# EAGLE design slush_alt_board_rev_a (EAGLE 8.5.0)
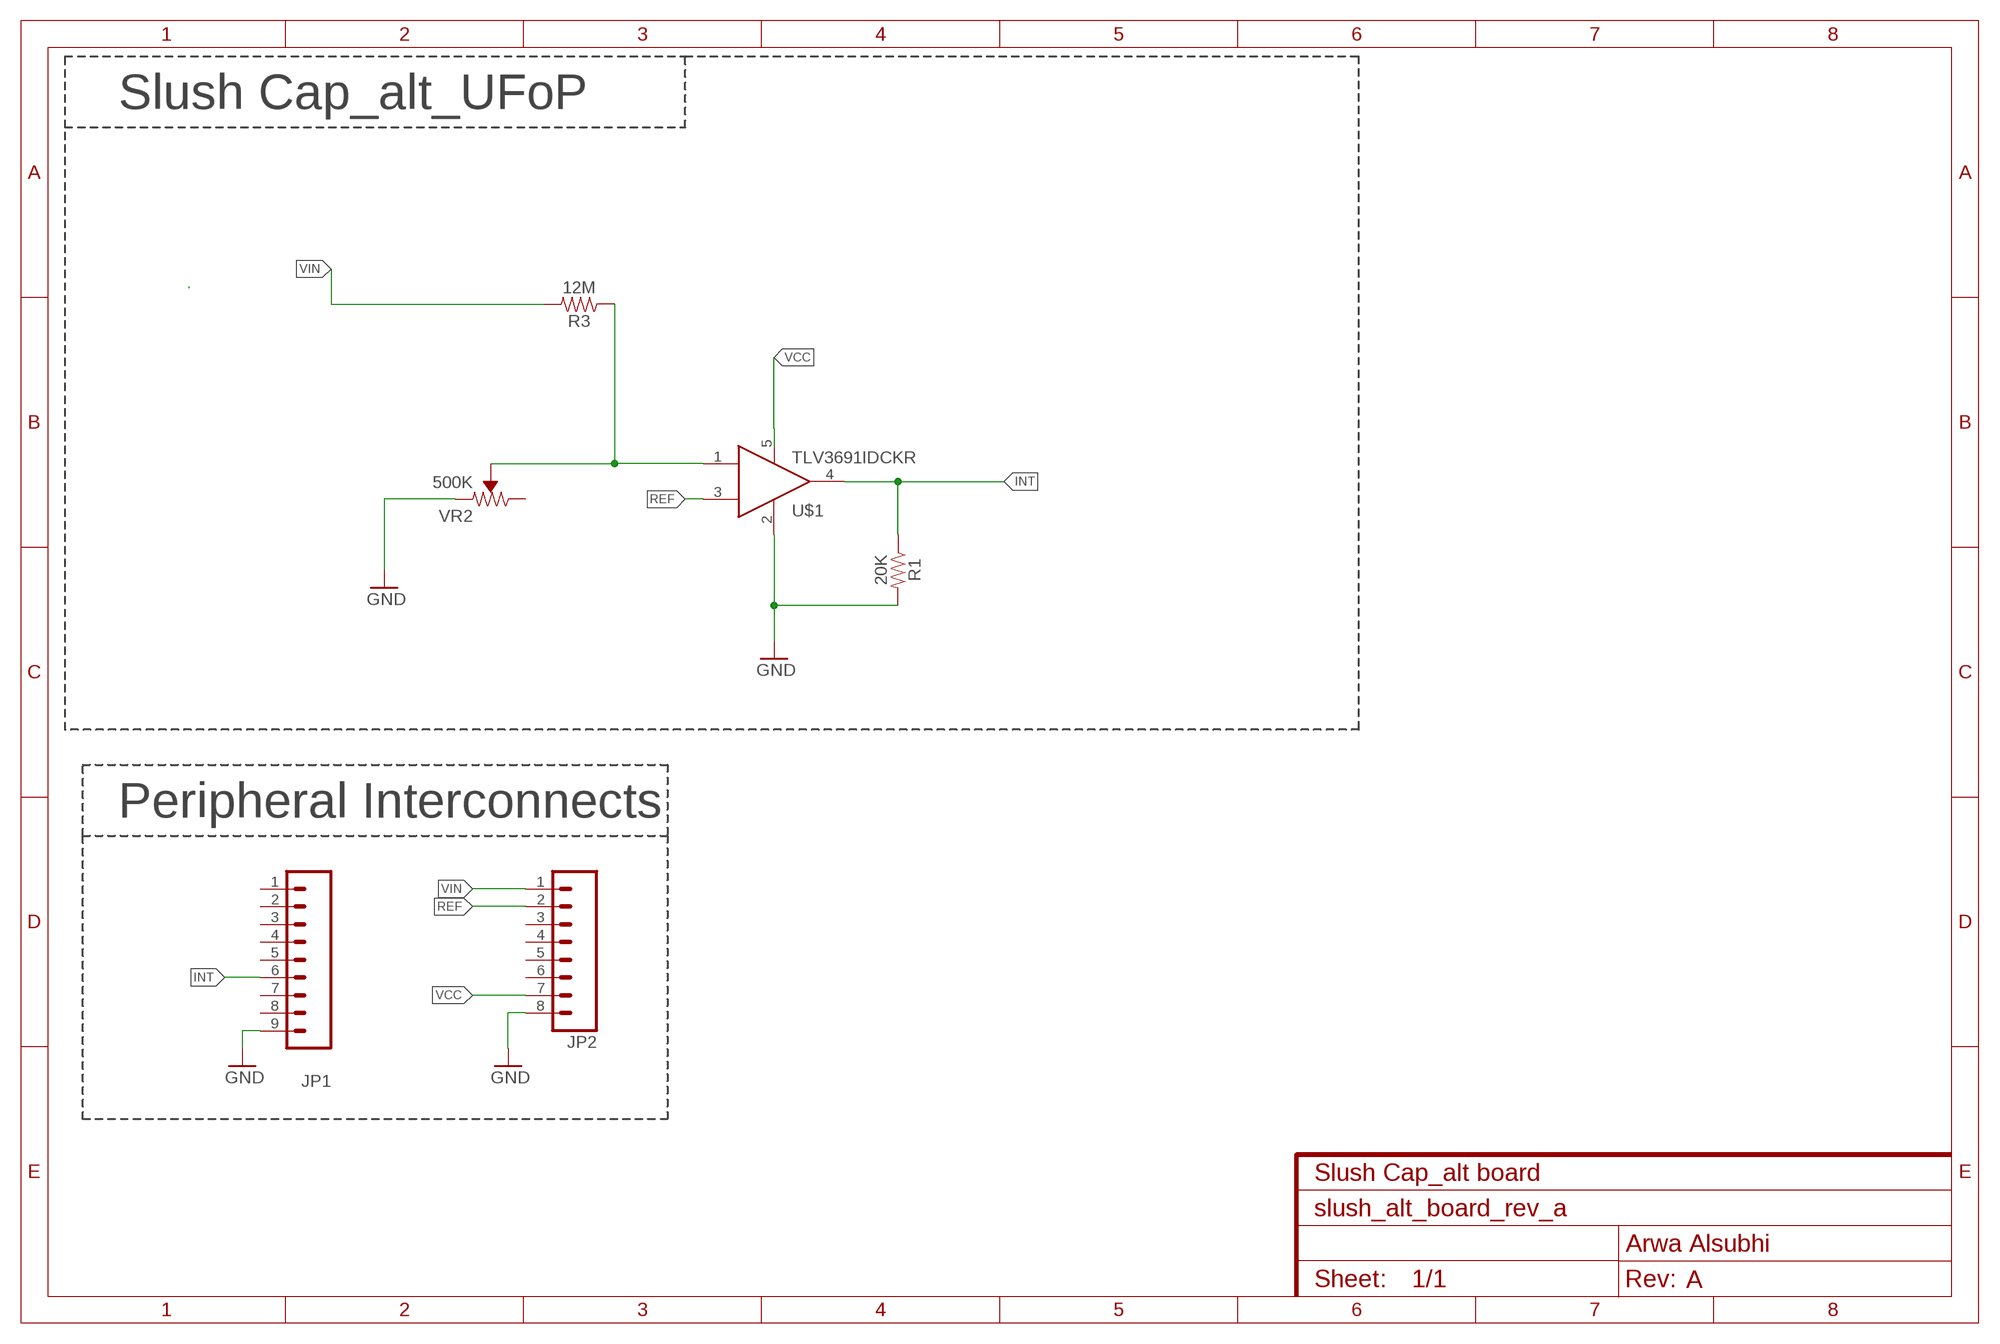
[diagram p0: schematic, sheet 1]
FRAME2 (FRAME-A4L): CNAME: Slush Cap_alt board; CREVISION: A; DESIGNER: Arwa Alsubhi

## Parts
JP1  M091.27MM  [1X09-1.27MM]
JP2  M081.27MM  [1X08-1.27MM]
R1  20K  0.3OHM-0805-1/8W-1%  [0805]
R3  12M  0.3OHM-0805-1/8W-1%  [0805]
U$1  TLV3691IDCKR  [SOT353]
VR2  500K  TRIMPOT-SMD-3MM-CLOSED-1/8W-20%  [TRIMPOT-SMD-3MM-CLOSED]

## Nets
GND: JP1.9 JP2.8 R1.2 U$1.2 VR2.1(CCW)
INT: JP1.6 R1.1 U$1.4
N$1: R3.2
N$5: R3.1 U$1.1 VR2.2(WIPER)
REF: JP2.2 U$1.3
VCC: JP2.7 U$1.5
VIN: JP2.1
Unconnected: JP1.1 JP1.2 JP1.3 JP1.4 JP1.5 JP1.7 JP1.8 JP2.3 JP2.4 JP2.5 JP2.6 VR2.3(CW)

## Notes on the sheet
- Slush Cap_alt_UFoP
- Peripheral Interconnects

## Library data of the parts
JP1 = SparkFun-Connectors:M09: Header 9 Standard 9-pin 0.1" header. Use with straight break away headers (SKU : PRT-00116), right angle break away headers (PRT-00553), swiss pins (PRT-00743), machine pins (PRT-00117), and female headers (PRT-00115).; DIGIKEY: S9014E-09-ND; MANUFACTURERPARTNUMBER: GRPB091VWVN-RC; MPN: GRPB091VWVN-RC
JP2 = SparkFun-Connectors:M08: Header 8 Standard 8-pin 0.1" header. Use with straight break away headers (SKU : PRT-00116), right angle break away headers (PRT-00553), swiss pins (PRT-00743), machine pins (PRT-00117), and female headers (PRT-00115).; DIGIKEY: S9014E-08-ND; MANUFACTURERPARTNUMBER: GRPB081VWVN-RC; MPN: GRPB081VWVN-RC
R1 R3 = SparkFun-Resistors:0.3OHM: 0.3Ω resistor A resistor is a passive two-terminal electrical component that implements electrical resistance as a circuit element. Resistors act to reduce current flow, and, at the same time, act to lower voltage levels within circuits. - Wikipedia; PROD_ID: RES-11622; VALUE: 0.3
U$1 = Arwa_lib:TLV3691IDCKR
VR2 = SparkFun-Resistors:TRIMPOT: Trimming Potentiometer (Trimpot) Three-terminal potentiometers, with an adjustable wiper and two adjustable resistors. A pot can be used to create a configurable voltage divider, or as a variable resistor. "Trimpots" are a subset of potentiometers, usually intended for "set-and-forget" applications. They're often more delicate than standard potentiometers - rated for fewer turns. Variants PTH-KNOB - PTH Trimpot w/ finger-adjustable knob Trimpot 10K with Knob <https://www.sparkfun.com/products/9806> (COM-09806) Datasheet <http://www.sparkfun.com/datasheets/Components/General/TSR-3386.pdf> SMD-3MM-CLOSED-FRAME - SMD 3mm Square Closed-Frame Trimpot Used on e.g. EasyDriver - Stepper Motor Driver <https://www.sparkfun.com/products/12779> Datasheet <http://www.bitechnologies.com/pdfs/22.pdf> (22AR10KTR) SMD-5MM - SMD 5mm Square Closed-Frame Trimpot Used on e.g. IOIO-OTG - V2.2 <https://www.sparkfun.com/products/13613> Datasheet <http://www.vishay.com/docs/51008/ts53.pdf> (TS53YL502MR10) SMD-3MM-1/10W-25% - 3mm Square Open-Frame Trimpot Used on e.g. SparkFun Shapeoko <https://www.sparkfun.com/products/13899> Datasheet <http://www.bourns.com/docs/Product-Datasheets/TC33.pdf> (TC33X-2-103E); PROD_ID: RES-09285; VALUE: 10k

## Board
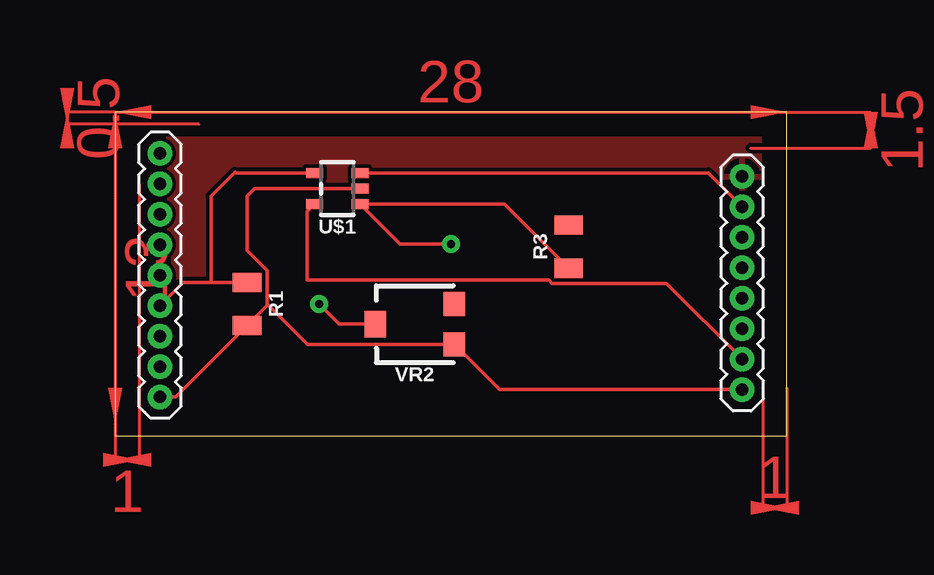
[diagram p1: board, top side]
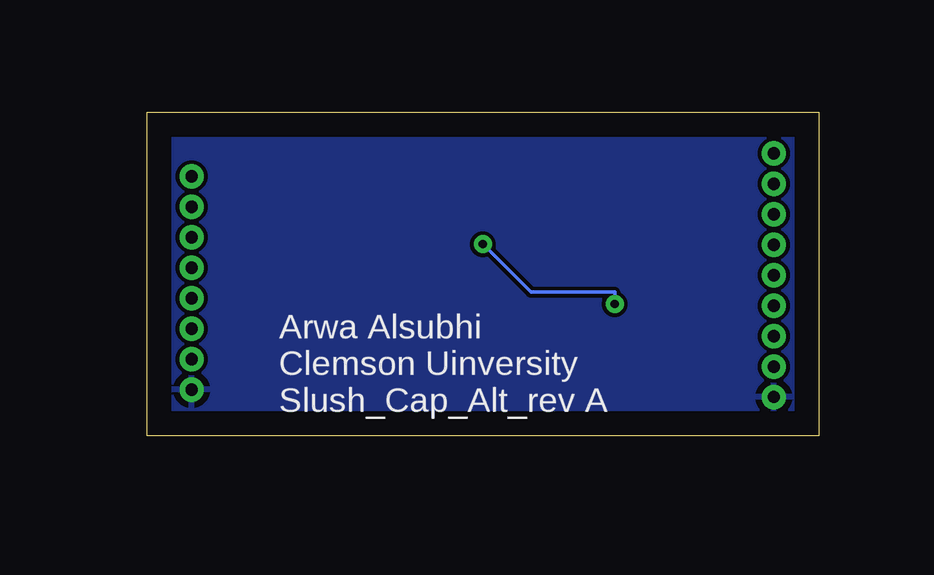
[diagram p2: board, bottom side, seen from below]

Size 28 x 13.5 mm. Coordinates in mm from the lower left corner, seen from the top.
Outline: 0,0 28,0 28,13.5 0,13.5 0,0
Copper layers (1*16): Top 0.035mm / dielectric 1.5mm / Bottom 0.035mm
Design rules "default": minimum track width 6mil, minimum drill 0.35mm, track to track 6mil, track to pad 6mil, pad to pad 6mil, via to via 6mil, smd to smd 6mil, copper to edge 40mil, drill to drill 6mil, minimum pad ring 10mil, minimum via ring 8mil, stop-mask expansion 4mil, vias tented up to drill 0mil, thermal gap 10mil

### Footprints (pad centres in the part's own frame; a part is rotated, then mirrored left to right if it is on the bottom)
1X09-1.27MM = drill 0.508 pad 1: 1 0,0; 2 1.27,0; 3 2.54,0; 4 3.81,0; 5 5.08,0; 6 6.35,0; 7 7.62,0; 8 8.89,0; 9 10.16,0
1X08-1.27MM = drill 0.508 pad 1: 1 0,0; 2 1.27,0; 3 2.54,0; 4 3.81,0; 5 5.08,0; 6 6.35,0; 7 7.62,0; 8 8.89,0
0805 = smd 0.8 x 1.2: 1 -0.9,0; 2 0.9,0
SOT353 = smd 0.42 x 0.7: 1 -0.65,-0.95; 2 0,-0.95; 3 0.65,-0.95; 4 0.65,0.95; 5 -0.65,0.95
TRIMPOT-SMD-3MM-CLOSED = smd 1 x 0.9: 1 -0.85,-1.65; 3 0.85,-1.65 | smd 1.1 x 0.9: 2 0,1.65

### Placement (x,y rotation side)
JP1  1.87,11.78 270 top
JP2  26.14,10.82 270 top
R1  5.5,5.5 270 top
R3  18.91,7.89 90 top
U$1  9.26,10.31 90 top
VR2  12.49,4.66 90 top

### Tracks (layer width: path | path; a pad name or v marks a point on that pad's centre or on a via)
GND
  Top 0.152: JP1.9 2.52,1.62 R1.2 6.33,5.43 6.33,5.5 | U$1.2 5.81,10.31 5.5,10 5.5,7.72 6.33,6.89 6.33,5.5 | 6.33,5.5 8.02,3.81 VR2.1 16.02,1.93 JP2.8
  pour Bottom: 0,14 28,14 28,0 0,0
INT
  Top 0.152: R1.1 4,6.4 | 4,6.4 2.84,6.4 JP1.6 | U$1.4 5.04,10.96 5,11 4,10 4,6.4
N$5  (via drill 0.35)
  Top 0.152: R3.1 16.24,9.66 U$1.1 11.87,8 v14,8 | v8.5,5.5 9.34,4.66 VR2.2
  Bottom 0.152: v14,8 12,6 8.5,6 v8.5,5.5
REF
  Top 0.152: U$1.3 24.73,10.96 JP2.2
VCC
  Top 0.152: JP2.7 22.98,6.36 18.21,6.36 18.08,6.5 8,6.5 8,9.35 U$1.5
VIN
  pour Top: 0,14 28,14 28,-0.5 0,-0.5
(copper drawn outside any net)
  shapes: Top area x6

### Text on the board
bNames: Arwa Alsubhi / Clemson Uinversity / Slush_Cap_Alt_rev A